# EAGLE schematic Cree_XP-E_Turn (EAGLE 6.4)
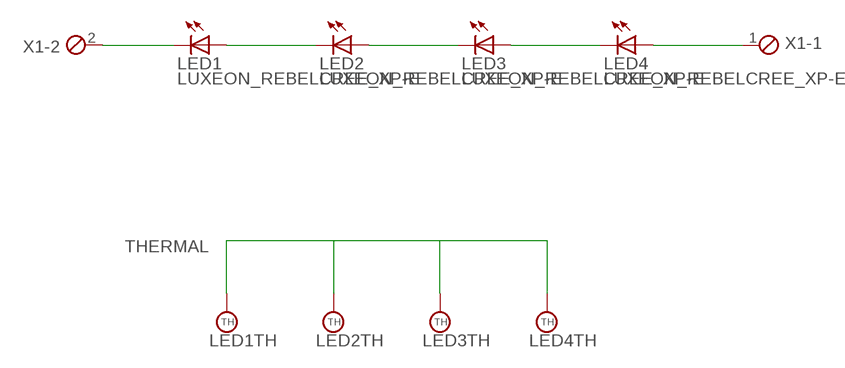
[diagram p0: schematic, sheet 1]

## Parts
LED1  LUXEON_REBELCREE_XP-E  [CREE_XP-E]
LED2  LUXEON_REBELCREE_XP-E  [CREE_XP-E]
LED3  LUXEON_REBELCREE_XP-E  [CREE_XP-E]
LED4  LUXEON_REBELCREE_XP-E  [CREE_XP-E]
X1  MPT2  [2POL254]

## Nets
N$2: LED1.AN(A) LED2.CT(C)
N$3: LED2.AN(A) LED3.CT(C)
N$4: LED3.AN(A) LED4.CT(C)
THERMAL: LED1.TH LED2.TH LED3.TH LED4.TH
V+: LED4.AN(A) X1.1
V-: LED1.CT(C) X1.2

## Library data of the parts
LED1-LED4 = Combined:LUXEON_REBEL: LUXEON Rebel Display layer 93, Pins, and connect all contact points with a net. The thermal pads are defined in a separate gate with addlevel REQUEST. Draw a net named 'TH' and connect all thermal pads with it. Please read the Package's Description about DRC settings. Source: http://www.lumileds.com/pdfs/AB32.pdf
X1 = con-phoenix-254:MPT2: PHOENIX CONNECTOR; OC_FARNELL: unknown; OC_NEWARK: unknown